# Altium project BOC1_06.PrjPcb (part 2 of 2)

## Sheet BOC_DAUGHTER.SchDoc: Board-On-Chip Daughter Connectors
size B; Organization: Altium Limited; Address1: L3, 12a Rodborough Rd; Address2: Frenchs Forest; Address3: NSW; Address4: Australia 2086; Revision: 1.06; SheetNumber: 8; SheetTotal: 16
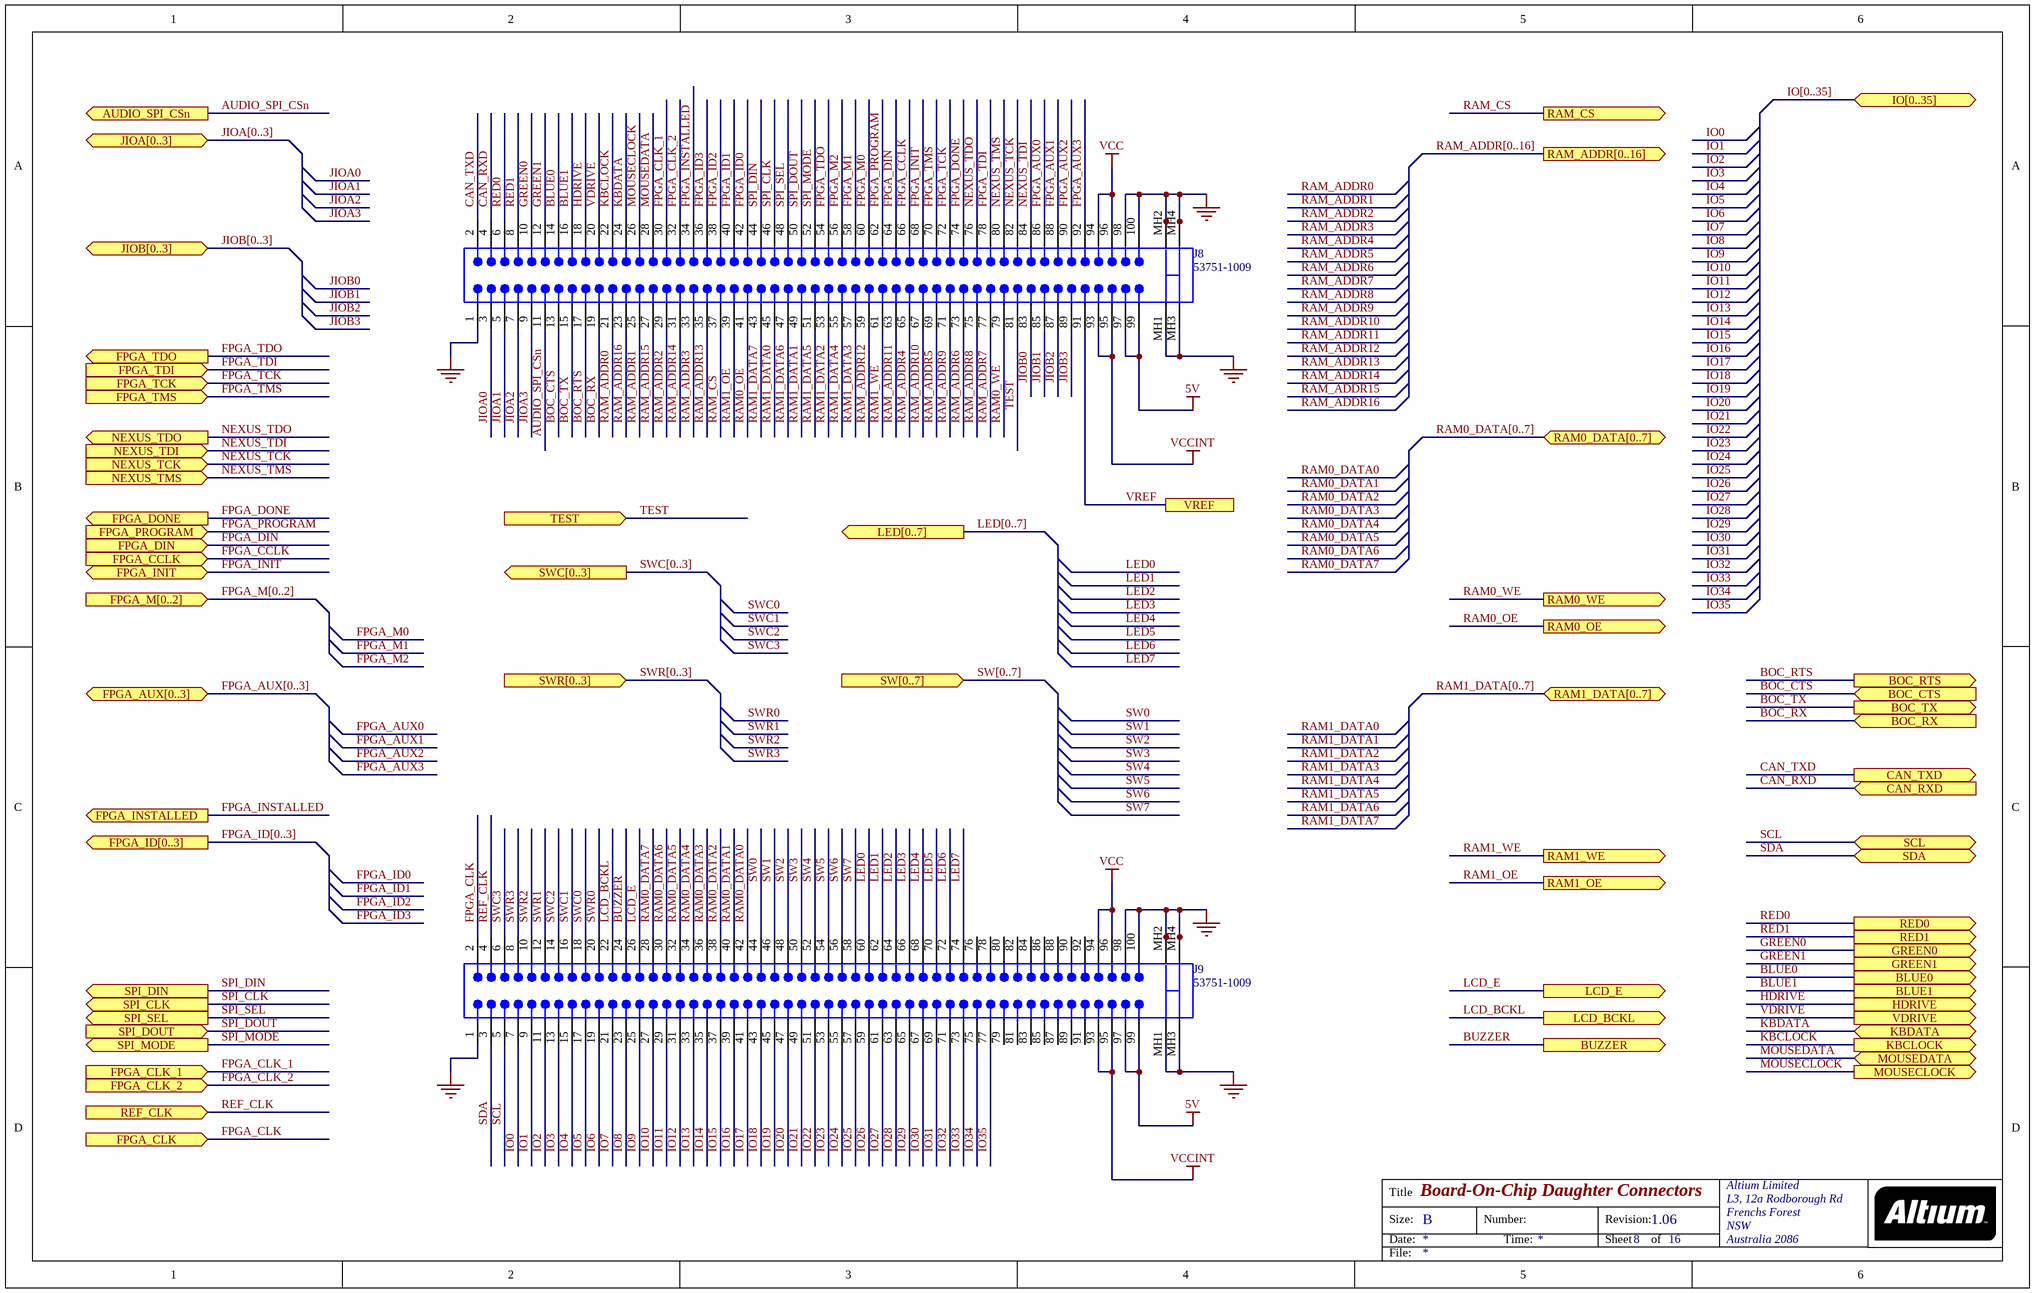
[diagram p13: BOC_DAUGHTER.SchDoc]

### Parts
J8  53751-1009  [53751]
J9  53751-1009  [53751]

### Ports
AUDIO_SPI_CSn (out), BLUE0 (out), BLUE1 (out), BOC_CTS (in), BOC_RTS (out), BOC_RX (in), BOC_TX (out), BUZZER (out), CAN_RXD (in), CAN_TXD (out), FPGA_AUX[0..3] (bidir), FPGA_CCLK (in), FPGA_CLK (in), FPGA_CLK_1 (in), FPGA_CLK_2 (in), FPGA_DIN (in), FPGA_DONE (out), FPGA_ID[0..3] (out), FPGA_INIT (bidir), FPGA_INSTALLED (out), FPGA_M[0..2] (in), FPGA_PROGRAM (in), FPGA_TCK (in), FPGA_TDI (in), FPGA_TDO (out), FPGA_TMS (in), GREEN0 (out), GREEN1 (out), HDRIVE (out), IO[0..35] (bidir), JIOA[0..3] (bidir), JIOB[0..3] (bidir), KBCLOCK (out), KBDATA (bidir), LCD_BCKL (out), LCD_E (out), LED[0..7] (out), MOUSECLOCK (out), MOUSEDATA (bidir), NEXUS_TCK (in), NEXUS_TDI (in), NEXUS_TDO (out), NEXUS_TMS (in), RAM0_DATA[0..7] (bidir), RAM0_OE (out), RAM0_WE (out), RAM1_DATA[0..7] (bidir), RAM1_OE (out), RAM1_WE (out), RAM_ADDR[0..16] (out), RAM_CS (out), RED0 (out), RED1 (out), REF_CLK (in), SCL (bidir), SDA (bidir), SPI_CLK (out), SPI_DIN (out), SPI_DOUT (in), SPI_MODE (out), SPI_SEL (out), SW[0..7] (in), SWC[0..3] (out), SWR[0..3] (in), TEST (in), VDRIVE (out), VREF

### Nets
5V: J8.97 J8.99 J9.97 J9.99
GND: J8.1 J8.98 J8.100 J8.MH1 J8.MH2 J8.MH2A J8.MH2B J8.MH3 J8.MH4 J8.MH4A J8.MH4B J9.1 J9.98 J9.100 J9.MH1 J9.MH2 J9.MH2A J9.MH2B J9.MH3 J9.MH4 J9.MH4A J9.MH4B
VCC: J8.94 J8.96 J9.94 J9.96
VCCINT: J8.93 J8.95 J9.93 J9.95
AUDIO_SPI_CSn: J8.11 ; port AUDIO_SPI_CSn
BLUE0: J8.14 ; port BLUE0
BLUE1: J8.16 ; port BLUE1
BOC_CTS: J8.13 ; port BOC_CTS
BOC_RTS: J8.17 ; port BOC_RTS
BOC_RX: J8.19 ; port BOC_RX
BOC_TX: J8.15 ; port BOC_TX
BUZZER: J9.24 ; port BUZZER
CAN_RXD: J8.4 ; port CAN_RXD
CAN_TXD: J8.2 ; port CAN_TXD
FPGA_AUX0: J8.86
FPGA_AUX1: J8.88
FPGA_AUX2: J8.90
FPGA_AUX3: J8.92
FPGA_CCLK: J8.66 ; port FPGA_CCLK
FPGA_CLK: J9.2 ; port FPGA_CLK
FPGA_CLK_1: J8.30 ; port FPGA_CLK_1
FPGA_CLK_2: J8.32 ; port FPGA_CLK_2
FPGA_DIN: J8.64 ; port FPGA_DIN
FPGA_DONE: J8.74 ; port FPGA_DONE
FPGA_ID0: J8.42
FPGA_ID1: J8.40
FPGA_ID2: J8.38
FPGA_ID3: J8.36
FPGA_INIT: J8.68 ; port FPGA_INIT
FPGA_INSTALLED: J8.34 ; port FPGA_INSTALLED
FPGA_M0: J8.60
FPGA_M1: J8.58
FPGA_M2: J8.56
FPGA_PROGRAM: J8.62 ; port FPGA_PROGRAM
FPGA_TCK: J8.72 ; port FPGA_TCK
FPGA_TDI: J8.78 ; port FPGA_TDI
FPGA_TDO: J8.54 ; port FPGA_TDO
FPGA_TMS: J8.70 ; port FPGA_TMS
GREEN0: J8.10 ; port GREEN0
GREEN1: J8.12 ; port GREEN1
HDRIVE: J8.18 ; port HDRIVE
IO0: J9.7
IO1: J9.9
IO2: J9.11
IO3: J9.13
IO4: J9.15
IO5: J9.17
IO6: J9.19
IO7: J9.21
IO8: J9.23
IO9: J9.25
IO10: J9.27
IO11: J9.29
IO12: J9.31
IO13: J9.33
IO14: J9.35
IO15: J9.37
IO16: J9.39
IO17: J9.41
IO18: J9.43
IO19: J9.45
IO20: J9.47
IO21: J9.49
IO22: J9.51
IO23: J9.53
IO24: J9.55
IO25: J9.57
IO26: J9.59
IO27: J9.61
IO28: J9.63
IO29: J9.65
IO30: J9.67
IO31: J9.69
IO32: J9.71
IO33: J9.73
IO34: J9.75
IO35: J9.77
JIOA0: J8.3
JIOA1: J8.5
JIOA2: J8.7
JIOA3: J8.9
JIOB0: J8.83
JIOB1: J8.85
JIOB2: J8.87
JIOB3: J8.89
KBCLOCK: J8.22 ; port KBCLOCK
KBDATA: J8.24 ; port KBDATA
LCD_BCKL: J9.22 ; port LCD_BCKL
LCD_E: J9.26 ; port LCD_E
LED0: J9.60
LED1: J9.62
LED2: J9.64
LED3: J9.66
LED4: J9.68
LED5: J9.70
LED6: J9.72
LED7: J9.74
MOUSECLOCK: J8.26 ; port MOUSECLOCK
MOUSEDATA: J8.28 ; port MOUSEDATA
NEXUS_TCK: J8.82 ; port NEXUS_TCK
NEXUS_TDI: J8.84 ; port NEXUS_TDI
NEXUS_TDO: J8.76 ; port NEXUS_TDO
NEXUS_TMS: J8.80 ; port NEXUS_TMS
RAM0_DATA0: J9.42
RAM0_DATA1: J9.40
RAM0_DATA2: J9.38
RAM0_DATA3: J9.36
RAM0_DATA4: J9.34
RAM0_DATA5: J9.32
RAM0_DATA6: J9.30
RAM0_DATA7: J9.28
RAM0_OE: J8.41 ; port RAM0_OE
RAM0_WE: J8.79 ; port RAM0_WE
RAM1_DATA0: J8.45
RAM1_DATA1: J8.49
RAM1_DATA2: J8.53
RAM1_DATA3: J8.57
RAM1_DATA4: J8.55
RAM1_DATA5: J8.51
RAM1_DATA6: J8.47
RAM1_DATA7: J8.43
RAM1_OE: J8.39 ; port RAM1_OE
RAM1_WE: J8.61 ; port RAM1_WE
RAM_ADDR0: J8.21
RAM_ADDR1: J8.25
RAM_ADDR2: J8.29
RAM_ADDR3: J8.33
RAM_ADDR4: J8.65
RAM_ADDR5: J8.69
RAM_ADDR6: J8.73
RAM_ADDR7: J8.77
RAM_ADDR8: J8.75
RAM_ADDR9: J8.71
RAM_ADDR10: J8.67
RAM_ADDR11: J8.63
RAM_ADDR12: J8.59
RAM_ADDR13: J8.35
RAM_ADDR14: J8.31
RAM_ADDR15: J8.27
RAM_ADDR16: J8.23
RAM_CS: J8.37 ; port RAM_CS
RED0: J8.6 ; port RED0
RED1: J8.8 ; port RED1
REF_CLK: J9.4 ; port REF_CLK
SCL: J9.5 ; port SCL
SDA: J9.3 ; port SDA
SPI_CLK: J8.46 ; port SPI_CLK
SPI_DIN: J8.44 ; port SPI_DIN
SPI_DOUT: J8.50 ; port SPI_DOUT
SPI_MODE: J8.52 ; port SPI_MODE
SPI_SEL: J8.48 ; port SPI_SEL
SW0: J9.44
SW1: J9.46
SW2: J9.48
SW3: J9.50
SW4: J9.52
SW5: J9.54
SW6: J9.56
SW7: J9.58
SWC0: J9.18
SWC1: J9.16
SWC2: J9.14
SWC3: J9.6
SWR0: J9.20
SWR1: J9.12
SWR2: J9.10
SWR3: J9.8
TEST: J8.81 ; port TEST
VDRIVE: J8.20 ; port VDRIVE
VREF: J8.91 ; port VREF

Not connected (* = marked no-connect by the designer): J9 76 78 79 80 81 82 83 84 85 86 87 88 89 90 91 92

### Buses and harness runs
bus FPGA_AUX[0..3] = port FPGA_AUX[0..3]
bus FPGA_ID[0..3] = port FPGA_ID[0..3]
bus FPGA_M[0..2] = port FPGA_M[0..2]
bus IO[0..35] = port IO[0..35]
bus JIOA[0..3] = port JIOA[0..3]
bus JIOB[0..3] = port JIOB[0..3]
bus LED[0..7] = port LED[0..7]
bus RAM0_DATA[0..7] = port RAM0_DATA[0..7]
bus RAM1_DATA[0..7] = port RAM1_DATA[0..7]
bus RAM_ADDR[0..16] = port RAM_ADDR[0..16]
bus SW[0..7] = port SW[0..7]
bus SWC[0..3] = port SWC[0..3]
bus SWR[0..3] = port SWR[0..3]

### Notes on the sheet
- Title
- Size:
- Date:
- B
- Number:
- Time:
- Revision:
- Sheet
- of
- File:

### Library data of the parts
J8 J9 = 53751-1009: Board-to-Board, Docking Station, 0.80mm (.031") Pitch, Shielded Plug, Vertical, Ultra Low Profile, SMT; Manufacturer: Molex; Package Information: Latest Revision: Jun-2001; Mating Height: 8.5mm; Voltage: 100V; Current: 0.5A; Contact Resistance: 40mOhm max; PCB Layout: Complies with Manufacturer's Recommendation.; Fitted: True; Published: 15-Oct-2003; Datasheet: Latest Revision: Feb-2002; Package Reference: 53751; Publisher: Altium Limited

## Sheet BOC_Boot.SchDoc: Board-On-Chip Bootup Circuits
size B; Organization: Altium Limited; Address1: L3, 12a Rodborough Rd; Address2: Frenchs Forest; Address3: NSW; Address4: Australia 2086; Revision: 1.06; SheetNumber: 2; SheetTotal: 16
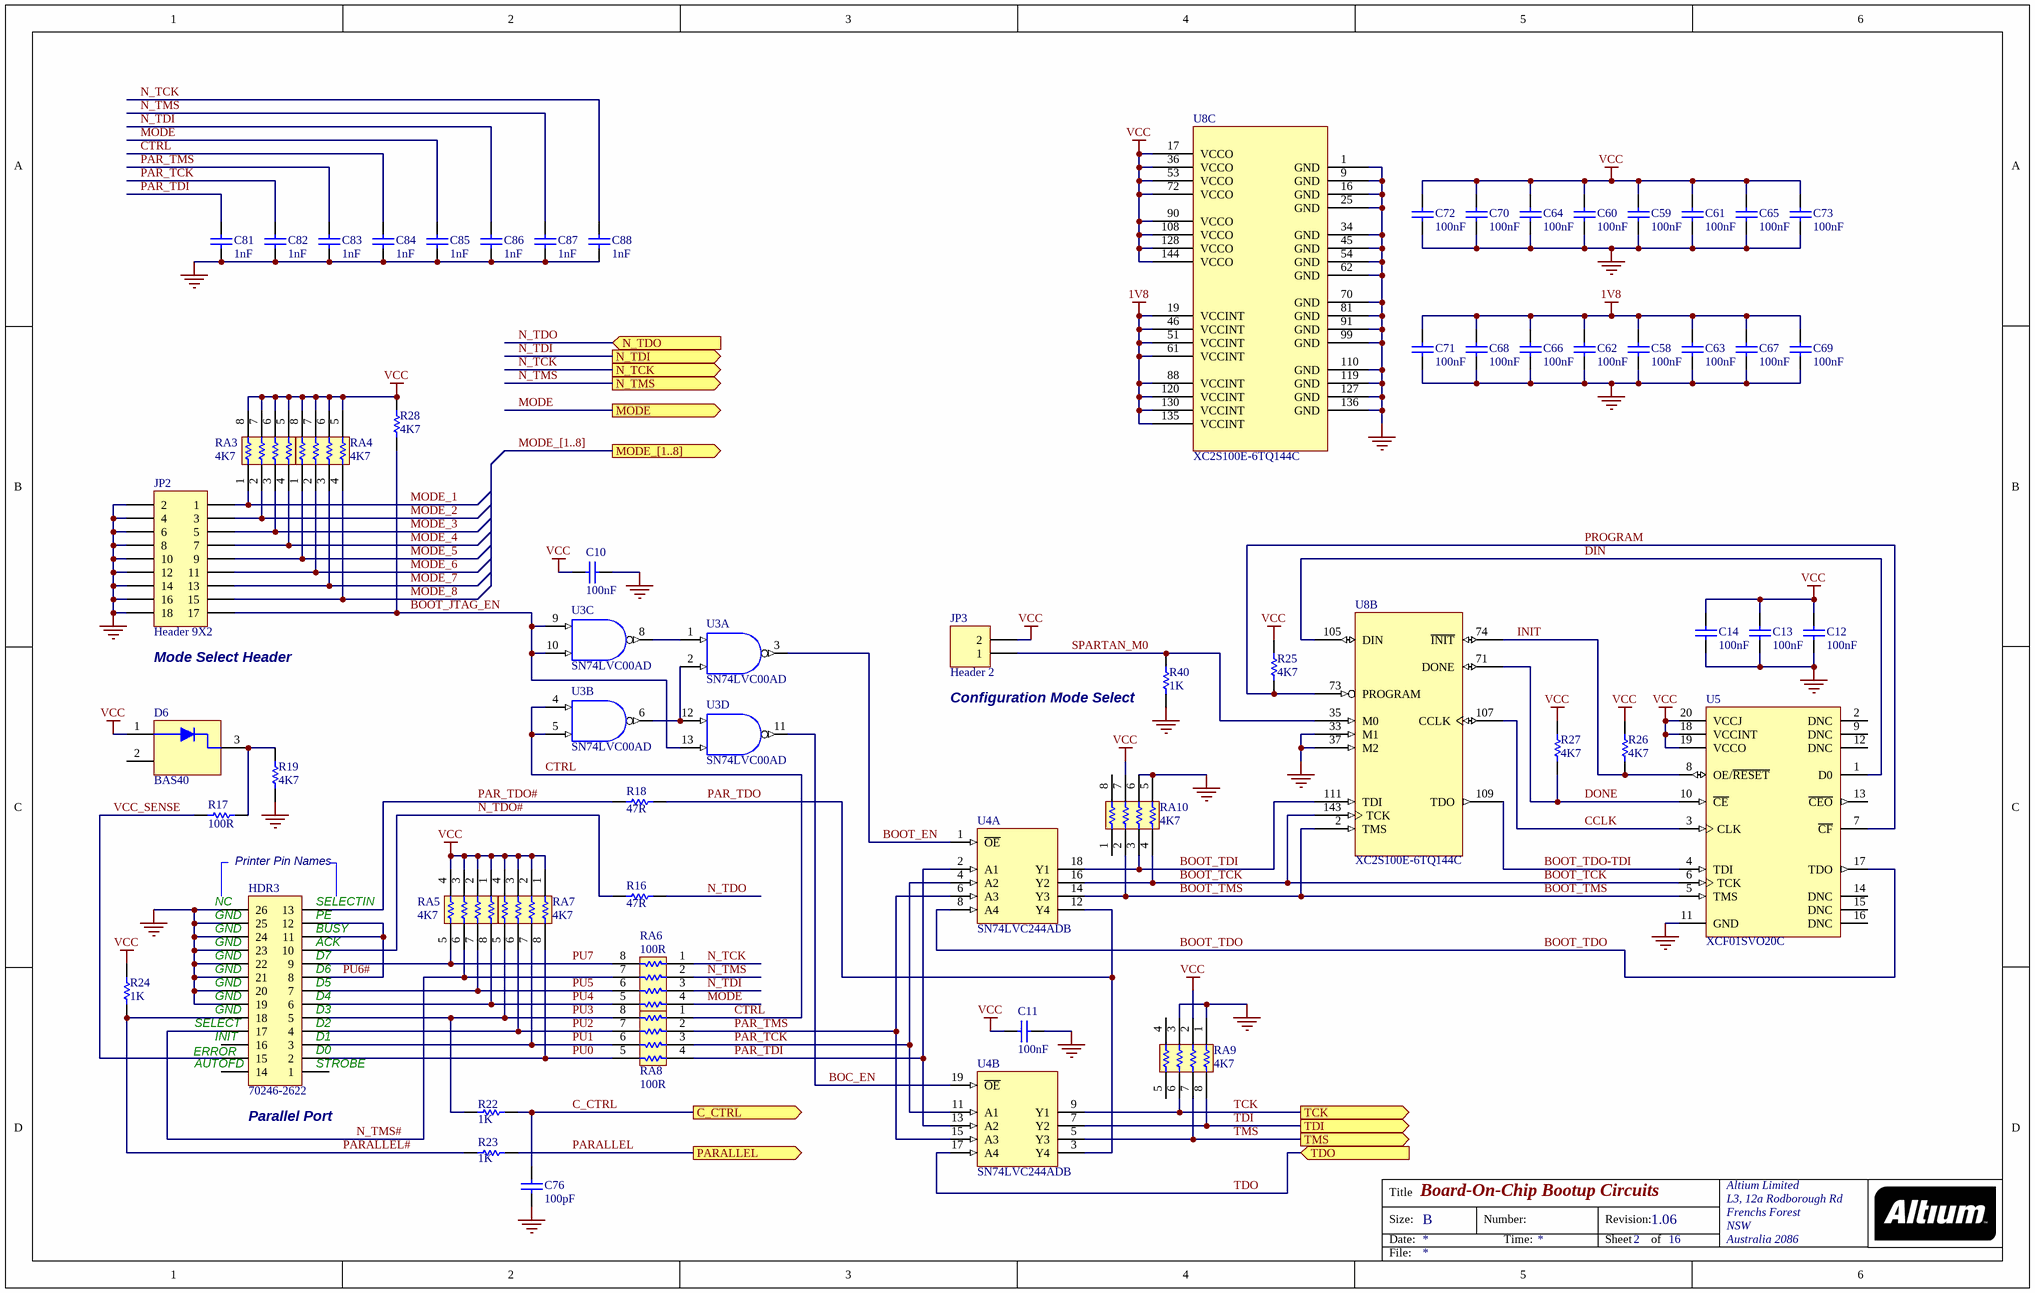
[diagram p14: BOC_Boot.SchDoc]

### Parts
C10  100nF  [CC2012-0805]
C11  100nF  [CC2012-0805]
C12  100nF  [CC2012-0805]
C13  100nF  [CC2012-0805]
C14  100nF  [CC2012-0805]
C58  100nF  [CC2012-0805]
C59  100nF  [CC2012-0805]
C60  100nF  [CC2012-0805]
C61  100nF  [CC2012-0805]
C62  100nF  [CC2012-0805]
C63  100nF  [CC2012-0805]
C64  100nF  [CC2012-0805]
C65  100nF  [CC2012-0805]
C66  100nF  [CC2012-0805]
C67  100nF  [CC2012-0805]
C68  100nF  [CC2012-0805]
C69  100nF  [CC2012-0805]
C70  100nF  [CC2012-0805]
C71  100nF  [CC2012-0805]
C72  100nF  [CC2012-0805]
C73  100nF  [CC2012-0805]
C76  100pF  [CC2012-0805]
C81  1nF  [CC2012-0805]
C82  1nF  [CC2012-0805]
C83  1nF  [CC2012-0805]
C84  1nF  [CC2012-0805]
C85  1nF  [CC2012-0805]
C86  1nF  [CC2012-0805]
C87  1nF  [CC2012-0805]
C88  1nF  [CC2012-0805]
D6  BAS40  [SO-G3]
HDR3  70246-2622  Usage: Parallel Port  [HDR2X13_CEN_LP]
JP2  Header 9X2  Usage: Mode Select Header  [HDR2X9]
JP3  Header 2  Usage: Configuration Mode Select  [HDR1X2]
R16  47R  [CC2012-0805]
R17  100R  [CC2012-0805]
R18  47R  [CC2012-0805]
R19  4K7  [CC2012-0805]
R22  1K  [CC2012-0805]
R23  1K  [CC2012-0805]
R24  1K  [CC2012-0805]
R25  4K7  [CC2012-0805]
R26  4K7  [CC2012-0805]
R27  4K7  [CC2012-0805]
R28  4K7  [CC2012-0805]
R40  1K  [CC2012-0805]
RA3  4K7  [MNR34]
RA4  4K7  [MNR34]
RA5  4K7  [MNR34]
RA6  100R  [MNR34]
RA7  4K7  [MNR34]
RA8  100R  [MNR34]
RA9  4K7  [MNR34]
RA10  4K7  [MNR34]
U3  SN74LVC00AD  [SO-G14/Y2.2]  (parts A,B,C,D of 4)
U4  SN74LVC244ADB  [SSO-G20/P.65]  (parts A,B of 2)
U5  XCF01SVO20C  [VO20]
U8  XC2S100E-6TQ144C  [TQ144]  (parts B,C of 3)

### Ports
C_CTRL (out), MODE (out), MODE_[1..8] (out), N_TCK (out), N_TDI (out), N_TDO (in), N_TMS (out), PARALLEL (out), TCK (out), TDI (out), TDO (in), TMS (out)

### Nets
1V8: C58.1 C62.1 C63.1 C66.1 C67.1 C68.1 C69.1 C71.1 U8.19(VCCINT) U8.46(VCCINT) U8.51(VCCINT) U8.61(VCCINT) U8.88(VCCINT) U8.120(VCCINT) U8.130(VCCINT) U8.135(VCCINT)
GND: C10.2 C11.2 C12.1 C13.1 C14.1 C58.2 C59.2 C60.2 C61.2 C62.2 C63.2 C64.2 C65.2 C66.2 C67.2 C68.2 C69.2 C70.2 C71.2 C72.2 C73.2 C76.2 C81.2 C82.2 C83.2 C84.2 C85.2 C86.2 C87.2 C88.2 HDR3.19 HDR3.20 HDR3.21 HDR3.22 HDR3.23 HDR3.24 HDR3.25 HDR3.26 JP2.2 JP2.4 JP2.6 JP2.8 JP2.10 JP2.12 JP2.14 JP2.16 JP2.18 R19.2 R40.1 RA9.1 RA9.3 RA10.5 RA10.6 U3.7(GND) U4.10(GND) U5.11(GND) U8.1(GND) U8.9(GND) U8.16(GND) U8.25(GND) U8.33(M1) U8.34(GND) U8.37(M2) U8.45(GND) U8.54(GND) U8.62(GND) U8.70(GND) U8.81(GND) U8.91(GND) U8.99(GND) U8.110(GND) U8.119(GND) U8.127(GND) U8.136(GND)
VCC: C10.1 C11.1 C12.2 C13.2 C14.2 C59.1 C60.1 C61.1 C64.1 C65.1 C70.1 C72.1 C73.1 D6.1 JP3.2 R24.2 R25.1 R26.1 R27.1 R28.2 RA3.5 RA3.6 RA3.7 RA3.8 RA4.5 RA4.6 RA4.7 RA4.8 RA5.1 RA5.2 RA5.3 RA5.4 RA7.1 RA7.2 RA7.3 RA7.4 RA9.2 RA10.7 U3.14(VDD) U4.20(VCC) U5.18(VCCINT) U5.19(VCCO) U5.20(VCCJ) U8.17(VCCO) U8.36(VCCO) U8.53(VCCO) U8.72(VCCO) U8.90(VCCO) U8.108(VCCO) U8.128(VCCO) U8.144(VCCO)
BOC_EN: U3.11(Y) U4.19(~{OE})
BOOT_EN: U3.3(Y) U4.1(~{OE})
BOOT_JTAG_EN: JP2.17 R28.1 U3.9(A) U3.10(B) U3.13(B)
BOOT_TCK: RA10.4 U4.16(Y2) U5.6(TCK) U8.143(TCK)
BOOT_TDI: RA10.3 U4.18(Y1) U8.111(TDI)
BOOT_TDO: U4.8(A4) U5.17(TDO)
BOOT_TDO-TDI: U5.4(TDI) U8.109(TDO)
BOOT_TMS: RA10.2 U4.14(Y3) U5.5(TMS) U8.2(TMS)
C_CTRL: C76.1 R22.2 ; port C_CTRL
CCLK: U5.3(CLK) U8.107(CCLK)
CTRL: C84.1 RA8.1 U3.4(A) U3.5(B)
DIN: U5.1(D0) U8.105(DIN)
DONE: R27.2 U5.10(~{CE}) U8.71(DONE)
INIT: R26.2 U5.8(OE/~{RESET}) U8.74(~{INIT})
MODE: C85.1 RA6.4 ; port MODE
MODE_1: JP2.1 RA3.1
MODE_2: JP2.3 RA3.2
MODE_3: JP2.5 RA3.3
MODE_4: JP2.7 RA3.4
MODE_5: JP2.9 RA4.1
MODE_6: JP2.11 RA4.2
MODE_7: JP2.13 RA4.3
MODE_8: JP2.15 RA4.4
N_TCK: C88.1 RA6.1 ; port N_TCK
N_TDI: C86.1 RA6.3 ; port N_TDI
N_TDO: R16.2 ; port N_TDO
N_TDO#: HDR3.10 R16.1
N_TMS: C87.1 RA6.2 ; port N_TMS
N_TMS#: HDR3.17 RA5.6 RA6.7
PAR_TCK: C82.1 RA8.3 U4.4(A2) U4.11(A1)
PAR_TDI: C81.1 RA8.4 U4.2(A1) U4.13(A2)
PAR_TDO: R18.2 U4.3(Y4) U4.12(Y4)
PAR_TDO#: HDR3.13 R18.1
PAR_TMS: C83.1 RA8.2 U4.6(A3) U4.15(A3)
PARALLEL: R23.2 ; port PARALLEL
PARALLEL#: HDR3.18 R23.1 R24.1
PROGRAM: R25.2 U5.7(~{CF}) U8.73(PROGRAM)
PU0: HDR3.2 RA7.8 RA8.5
PU1: HDR3.3 RA7.7 RA8.6
PU2: HDR3.4 RA7.6 RA8.7
PU3: HDR3.5 R22.1 RA7.5 RA8.8
PU4: HDR3.6 RA5.8 RA6.5
PU5: HDR3.7 RA5.7 RA6.6
PU6#: HDR3.8 HDR3.11 HDR3.12
PU7: HDR3.9 RA5.5 RA6.8
SPARTAN_M0: JP3.1 R40.2 U8.35(M0)
TCK: RA9.6 U4.9(Y1) ; port TCK
TDI: RA9.8 U4.7(Y2) ; port TDI
TDO: U4.17(A4) ; port TDO
TMS: RA9.7 U4.5(Y3) ; port TMS
VCC_SENSE: HDR3.15 R17.1
NetD6_3: D6.3 R17.2 R19.1
NetU3_1: U3.1(A) U3.8(Y)
NetU3_2: U3.2(B) U3.6(Y) U3.12(A)

Not connected (* = marked no-connect by the designer): D6 2; HDR3 1 14 16; RA9 4 5; RA10 1 8; U5 2(DNC) 9(DNC) 12(DNC) 13(~{CEO}) 14(DNC) 15(DNC) 16(DNC)

### Buses and harness runs
bus MODE_[1..8] = port MODE_[1..8]

### Notes on the sheet
- (near HDR3) NC
- Printer Pin Names
- (near HDR3) SELECTIN
- (near HDR3) GND
- (near HDR3) PE
- (near HDR3) BUSY
- (near HDR3) ACK
- (near HDR3) D6
- (near HDR3) D7
- (near HDR3) SELECT
- (near HDR3) INIT
- (near HDR3) D1
- (near HDR3) D2
- (near HDR3) D3
- (near HDR3) D4
- (near HDR3) D5
- (near HDR3) ERROR
- (near HDR3) AUTOFD
- (near HDR3) STROBE
- (near HDR3) D0
- Title
- Size:
- Date:
- B
- Number:
- Time:
- Revision:
- Sheet
- of
- File:

### Library data of the parts
C10-C14 C58-C73 C76 C81-C88 = CAP: Capacitor; Fitted: True
D6 = BAS40: Shottky Diode; Fitted: True
HDR3 = Header 13X2A: Header, 13-Pin, Dual row; Manufacturer: Generic Components; Class I: Connector; Fitted: True; Revision: July-2002: Re-released for DXP Platform.; Publisher: Altium Limited
JP2 = Header 9X2: Header, 9-Pin, Dual row; Manufacturer: Generic Components; Class I: Connector; Fitted: True; Revision: July-2002: Re-released for DXP Platform.; Publisher: Altium Limited
JP3 = Header 2: Header, 2-Pin; Manufacturer: Generic Components; Class I: Connector; Fitted: True; Revision: July-2002: Re-released for DXP Platform.; Publisher: Altium Limited
R16-R19 R22-R28 R40 = RES: Resistor; Fitted: True
RA3-RA10 = MNR34: 3216x4 Resistor Array; Fitted: True
U3 = MC74HC00AD: Quad 2-Input NAND Gate; Manufacturer: Motorola; Package Information: Latest Revision: 1991; Class I: Logic; Fitted: True; Published: 15-Apr-2002; Datasheet: High-Speed CMOS Logic Data, DL129 Rev4 (1989); Package Reference: 751A-02; Publisher: Altium Limited; Class II: Gate
U4 = 74LVC244A: Octal Buffer/Driver with 3-State Outputs; Manufacturer: Philips; Package Information: Latest Revision: 1998; Class I: Logic; Class II: Buffer/Line Driver; Fitted: True; Published: 8-Jun-2000; Revision: July-2002: Re-released for DXP Platform.; Datasheet: Latest Revision: Jul-1998; Package Reference: SSOP20; Publisher: Altium Limited
U5 = XCF01SVO20C: XCF00S Series, Platform Flash In-System Programmable Configuration 3.3V PROM, 1-Megabit, Commercial Grade; Manufacturer: Xilinx; Package Information: Latest Revision: ver1.0, May-2003; Class I: Memory; Code - JEDEC: MO-153-AC; Fitted: True; Published: 20-Aug-2003; Datasheet: Latest Revision: ver1.1, June-2003; Package Reference: VO20; Publisher: Altium Limited; Class II: PROM
U8 = XC2S100E-6TQ144C: Spartan-IIE 1.8V FPGA, 144-Pin TQFP, Standard Performance, Commercial Grade; Manufacturer: Xilinx; Package Information: Latest Revision: ver1.1, Oct-2002; Class I: Field Programmable Gate Array; Code - JEDEC: MS-026-BFB; Code - IPC: SQFP20X20-144; Fitted: True; Published: 19-Jul-2002; Revision: 25-Aug-2003; Datasheet: Latest Revision: 14-Feb-2003; Package Reference: TQ144; Publisher: Altium Limited; Class II: Spartan-IIE

## Sheet BOC_Audio.SchDoc: Board-On-Chip Audio Interface
size A; Organization: Altium Limited; Address1: L3, 12a Rodborough Rd; Address2: Frenchs Forest; Address3: NSW; Address4: Australia 2086; Revision: 1.06; SheetNumber: 3; SheetTotal: 16
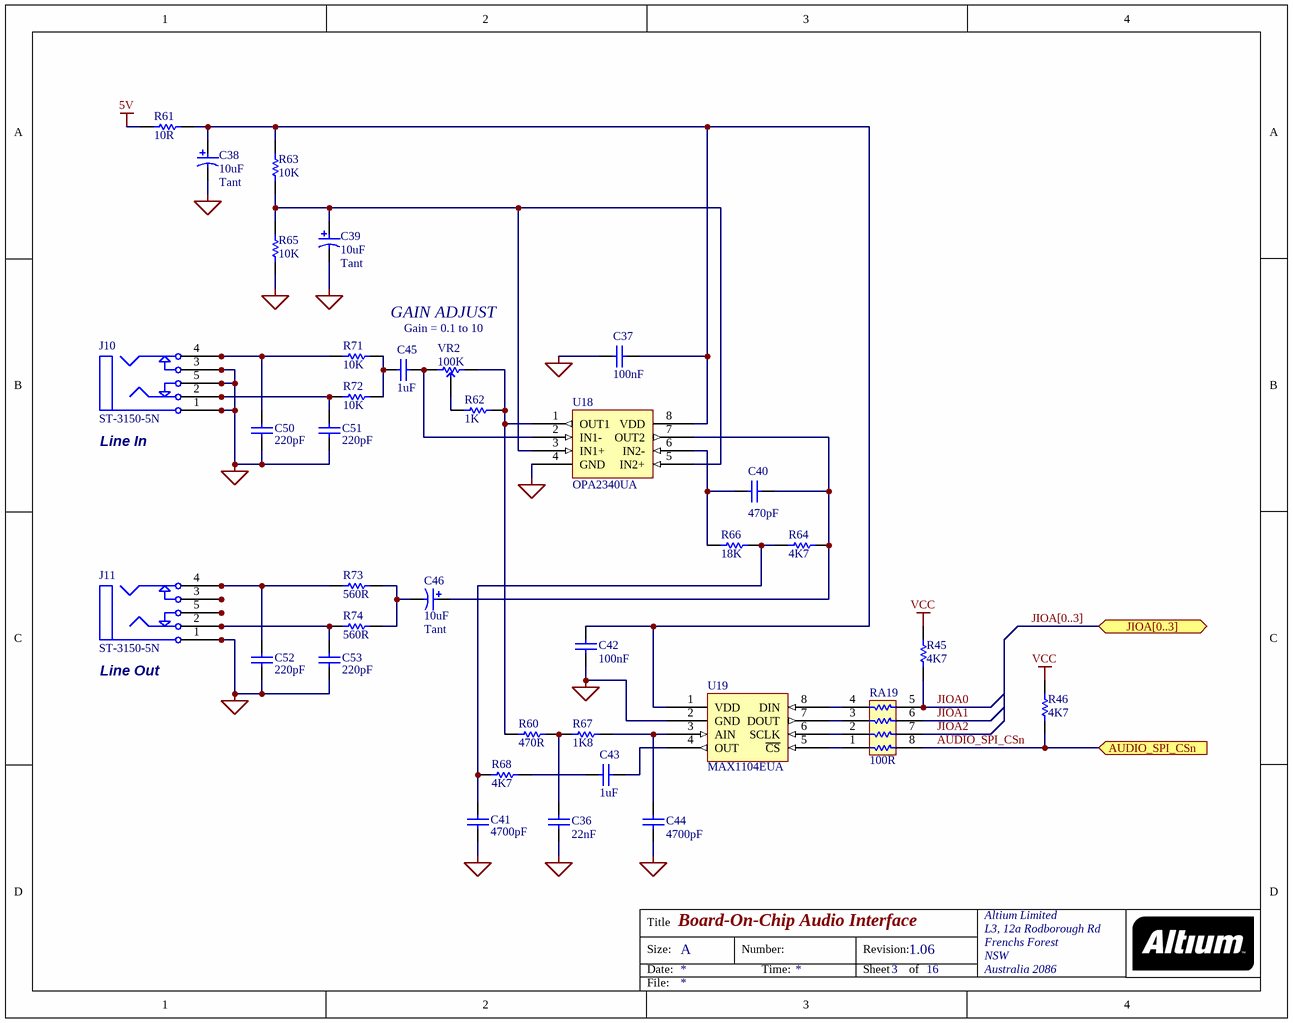
[diagram p15: BOC_Audio.SchDoc]

### Parts
C36  22nF  [CC2012-0805]
C37  100nF  [CC2012-0805]
C38  10uF  Capacitor Type: Tant  [MCCT-B]
C39  10uF  Capacitor Type: Tant  [MCCT-B]
C40  470pF  [CC2012-0805]
C41  4700pF  [CC2012-0805]
C42  100nF  [CC2012-0805]
C43  1uF  [C3216-1206]
C44  4700pF  [CC2012-0805]
C45  1uF  [C3216-1206]
C46  10uF  Capacitor Type: Tant  [MCCT-B]
C50  220pF  [CC2012-0805]
C51  220pF  [CC2012-0805]
C52  220pF  [CC2012-0805]
C53  220pF  [CC2012-0805]
J10  ST-3150-5N  [ST-3150-5N]
J11  ST-3150-5N  [ST-3150-5N]
R45  4K7  [CC2012-0805]
R46  4K7  [CC2012-0805]
R60  470R  [CC2012-0805]
R61  10R  [CC2012-0805]
R62  1K  [CC2012-0805]
R63  10K  [CC2012-0805]
R64  4K7  [CC2012-0805]
R65  10K  [CC2012-0805]
R66  18K  [CC2012-0805]
R67  1K8  [CC2012-0805]
R68  4K7  [CC2012-0805]
R71  10K  [CC2012-0805]
R72  10K  [CC2012-0805]
R73  560R  [CC2012-0805]
R74  560R  [CC2012-0805]
RA19  100R  [MNR34]
U18  OPA2340UA  [SO-G8]
U19  MAX1104EUA  [TSSO3X5-G8/X.35]
VR2  100K  [POT4MM-2]

### Ports
AUDIO_SPI_CSn (in), JIOA[0..3] (bidir)

### Nets
5V: R61.1
AGND: C36.2 C37.1 C38.2 C39.2 C41.2 C42.2 C44.2 C50.2 C51.2 C52.2 C53.2 J10.1 J10.1A J10.1B J10.3 J10.3A J10.3B J10.5 J10.5A J10.5B J11.1 J11.1A J11.1B R65.1 U18.4(GND) U19.2(GND)
VCC: R45.2 R46.2
AUDIO_SPI_CSn: R46.1 RA19.8 ; port AUDIO_SPI_CSn
JIOA0: R45.1 RA19.5
JIOA1: RA19.6
JIOA2: RA19.7
NetC36_1: C36.1 R60.2 R67.1
NetC37_2: C37.2 C38.1 C42.1 R61.2 R63.2 U18.8(VDD) U19.1(VDD)
NetC39_1: C39.1 R63.1 R65.2 U18.3(IN1+) U18.5(IN2+)
NetC40_1: C40.1 R66.2 U18.6(IN2-)
NetC40_2: C40.2 C46.1 R64.1 U18.7(OUT2)
NetC41_1: C41.1 R64.2 R66.1 R68.1
NetC43_1: C43.1 R68.2
NetC43_2: C43.2 U19.4(OUT)
NetC44_1: C44.1 R67.2 U19.3(AIN)
NetC45_1: C45.1 R71.2 R72.2
NetC45_2: C45.2 U18.2(IN1-) VR2.CCW(-)
NetC46_2: C46.2 R73.2 R74.2
NetC50_1: C50.1 J10.4 J10.4A J10.4B R71.1
NetC51_1: C51.1 J10.2 J10.2A J10.2B R72.1
NetC52_1: C52.1 J11.4 J11.4A J11.4B R73.1
NetC53_1: C53.1 J11.2 J11.2A J11.2B R74.1
NetJ11_3: J11.3 J11.3A J11.3B
NetJ11_5: J11.5 J11.5A J11.5B
NetR60_1: R60.1 R62.2 U18.1(OUT1) VR2.CW(+)
NetR62_1: R62.1 VR2.W
NetRA19_1: RA19.1 U19.5(~{CS})
NetRA19_2: RA19.2 U19.6(SCLK)
NetRA19_3: RA19.3 U19.7(DOUT)
NetRA19_4: RA19.4 U19.8(DIN)

### Buses and harness runs
bus JIOA[0..3] = port JIOA[0..3]

### Notes on the sheet
- GAIN ADJUST
- Gain = 0.1 to 10
- (near J10) Line In
- (near J11) Line Out
- Title
- Size:
- Date:
- A
- Number:
- Time:
- Revision:
- Sheet
- of
- File:

### Library data of the parts
C36 C37 C40-C45 C50-C53 = CAP: Capacitor; Fitted: True
C38 C39 C46 = CAP_POLAR: Polar Capacitor; Fitted: True
J10 J11 = ST-3150-5N: 3-Conductor Jack with 2 break contacts (normals) and 2 auxiliary make contacts; Manufacturer: Kycon; Class I: Connector; Fitted: True; Revision: December-2003: Created for NanoBoard.; Publisher: Altium Limited
R45 R46 R60-R68 R71-R74 = RES: Resistor; Fitted: True
RA19 = MNR34: 3216x4 Resistor Array; Fitted: True
U18 = OPA2340UA: Manufacturer: Burr-Brown; Fitted: True
U19 = MAX1104EUA: 8 bit CODEC with 4 wire logic interface; Manufacturer: Maxim; Fitted: True
VR2 = POT_M: Potentiometer; Fitted: True

## Nets that join several sheets
1V8: BOC_PWR (C21.1 C23.1 R42.1 U9.2), BOC_Boot (16 pins)
5V: BOC_IO (JP5.2 JP6.2), BOC_PWR (9 pins), BOC_ADC_DAC (HDR8.2), BOC_CAN (C4.1 J2.4 U2.3), BOC_LCD (LCD1.15 Q2.2 R30.1 R38.1), BOC_Spartan (R5.1), BOC_DAUGHTER (J8.97 J8.99 J9.97 J9.99), BOC_Audio (R61.1)
AGND: BOC_ADC_DAC (12 pins), BOC_Audio (26 pins)
GND: BOC_SRAM (6 pins), BOC_IO (HDR9.20 HDR10.20), BOC_KB (SW17.3 SW17.4), BOC_PWR (42 pins), BOC_RS232 (7 pins), BOC_ADC_DAC (HDR8.14 R80.1), BOC_CAN (7 pins), BOC_LED_DIPSWITCH (16 pins), BOC_CLK_ADJ (8 pins), BOC_LCD (16 pins), BOC_VGA_KB_MOUSE (17 pins), BOC_Spartan (36 pins), BOC_DAUGHTER (22 pins), BOC_Boot (74 pins)
VCC: BOC_SRAM (7 pins), BOC_IO (JP5.3 JP6.3), BOC_KB (5 pins), BOC_PWR (C16.1 C25.1 R47.1 U10.2), BOC_RS232 (C1.1 C2.1 C3.1 U1.16), BOC_ADC_DAC (R75.2 R77.1 R79.1), BOC_LED_DIPSWITCH (8 pins), BOC_CLK_ADJ (7 pins), BOC_LCD (5 pins), BOC_VGA_KB_MOUSE (12 pins), BOC_Spartan (32 pins), BOC_DAUGHTER (J8.94 J8.96 J9.94 J9.96), BOC_Boot (51 pins), BOC_Audio (R45.2 R46.2)
VCCINT: BOC_PWR (C24.1 C35.1 R56.1 U11.2), BOC_DAUGHTER (J8.93 J8.95 J9.93 J9.95)
AUDIO_SPI_CSn: BOC_DAUGHTER (J8.11), BOC_Audio (R46.1 RA19.8)
BLUE0: BOC_VGA_KB_MOUSE (R14.1), BOC_DAUGHTER (J8.14)
BLUE1: BOC_VGA_KB_MOUSE (R15.1), BOC_DAUGHTER (J8.16)
BOC_CTS: BOC_RS232 (R9.1), BOC_DAUGHTER (J8.13)
BOC_RTS: BOC_RS232 (U1.10), BOC_DAUGHTER (J8.17)
BOC_RX: BOC_RS232 (R1.1), BOC_DAUGHTER (J8.19)
BOC_TX: BOC_RS232 (U1.11), BOC_DAUGHTER (J8.15)
BUZZER: BOC_LCD (R37.1), BOC_DAUGHTER (J9.24)
C_CTRL: BOC_Spartan (U8.80), BOC_Boot (C76.1 R22.2)
C_SPI_CLOCK_CLK: BOC_CLK_ADJ (U12.8), BOC_Spartan (U8.141)
C_SPI_CLOCK_SEL: BOC_CLK_ADJ (R50.1 U12.9), BOC_Spartan (U8.142)
C_SPI_DIN: BOC_CLK_ADJ (U12.12), BOC_Spartan (U6.5 U7.5 U8.140)
CAN_RXD: BOC_CAN (R4.1), BOC_DAUGHTER (J8.4)
CAN_TXD: BOC_CAN (U2.1), BOC_DAUGHTER (J8.2)
FPGA_AUX0: BOC_Spartan (U8.41), BOC_DAUGHTER (J8.86)
FPGA_AUX1: BOC_Spartan (U8.42), BOC_DAUGHTER (J8.88)
FPGA_AUX2: BOC_Spartan (U8.43), BOC_DAUGHTER (J8.90)
FPGA_AUX3: BOC_Spartan (U8.44), BOC_DAUGHTER (J8.92)
FPGA_CCLK: BOC_Spartan (U8.24), BOC_DAUGHTER (J8.66)
FPGA_CLK: BOC_CLK_ADJ (R51.2 R53.2), BOC_Spartan (U8.126), BOC_DAUGHTER (J9.2)
FPGA_CLK_1: BOC_Spartan (U8.3), BOC_DAUGHTER (J8.30)
FPGA_CLK_2: BOC_Spartan (U8.4), BOC_DAUGHTER (J8.32)
FPGA_DIN: BOC_Spartan (U8.23), BOC_DAUGHTER (J8.64)
FPGA_DONE: BOC_Spartan (U8.29), BOC_DAUGHTER (J8.74)
FPGA_ID0: BOC_Spartan (U8.10), BOC_DAUGHTER (J8.42)
FPGA_ID1: BOC_Spartan (U8.8), BOC_DAUGHTER (J8.40)
FPGA_ID2: BOC_Spartan (U8.7), BOC_DAUGHTER (J8.38)
FPGA_ID3: BOC_Spartan (U8.6), BOC_DAUGHTER (J8.36)
FPGA_INIT: BOC_Spartan (U8.26), BOC_DAUGHTER (J8.68)
FPGA_INSTALLED: BOC_Spartan (R44.2 U8.5), BOC_DAUGHTER (J8.34)
FPGA_M0: BOC_Spartan (U8.21), BOC_DAUGHTER (J8.60)
FPGA_M1: BOC_Spartan (U8.20), BOC_DAUGHTER (J8.58)
FPGA_M2: BOC_Spartan (U8.18), BOC_DAUGHTER (J8.56)
FPGA_PROGRAM: BOC_Spartan (U8.22), BOC_DAUGHTER (J8.62)
FPGA_TCK: BOC_Spartan (U8.28), BOC_DAUGHTER (J8.72)
FPGA_TDI: BOC_Spartan (U8.31), BOC_DAUGHTER (J8.78)
FPGA_TDO: BOC_Spartan (RA16.1), BOC_DAUGHTER (J8.54)
FPGA_TMS: BOC_Spartan (U8.27), BOC_DAUGHTER (J8.70)
GREEN0: BOC_VGA_KB_MOUSE (R12.1), BOC_DAUGHTER (J8.10)
GREEN1: BOC_VGA_KB_MOUSE (R13.1), BOC_DAUGHTER (J8.12)
HDRIVE: BOC_VGA_KB_MOUSE (D4.3 J3.13), BOC_DAUGHTER (J8.18)
IO0: BOC_IO (HDR9.2), BOC_DAUGHTER (J9.7)
IO1: BOC_IO (HDR9.3), BOC_DAUGHTER (J9.9)
IO2: BOC_IO (HDR9.4), BOC_DAUGHTER (J9.11)
IO3: BOC_IO (HDR9.5), BOC_DAUGHTER (J9.13)
IO4: BOC_IO (HDR9.6), BOC_DAUGHTER (J9.15)
IO5: BOC_IO (HDR9.7), BOC_DAUGHTER (J9.17)
IO6: BOC_IO (HDR9.8), BOC_DAUGHTER (J9.19)
IO7: BOC_IO (HDR9.9), BOC_DAUGHTER (J9.21)
IO8: BOC_IO (HDR9.10), BOC_DAUGHTER (J9.23)
IO9: BOC_IO (HDR9.11), BOC_DAUGHTER (J9.25)
IO10: BOC_IO (HDR9.12), BOC_DAUGHTER (J9.27)
IO11: BOC_IO (HDR9.13), BOC_DAUGHTER (J9.29)
IO12: BOC_IO (HDR9.14), BOC_DAUGHTER (J9.31)
IO13: BOC_IO (HDR9.15), BOC_DAUGHTER (J9.33)
IO14: BOC_IO (HDR9.16), BOC_DAUGHTER (J9.35)
IO15: BOC_IO (HDR9.17), BOC_DAUGHTER (J9.37)
IO16: BOC_IO (HDR9.18), BOC_DAUGHTER (J9.39)
IO17: BOC_IO (HDR9.19), BOC_DAUGHTER (J9.41)
IO18: BOC_IO (HDR10.2), BOC_DAUGHTER (J9.43)
IO19: BOC_IO (HDR10.3), BOC_DAUGHTER (J9.45)
IO20: BOC_IO (HDR10.4), BOC_DAUGHTER (J9.47)
IO21: BOC_IO (HDR10.5), BOC_DAUGHTER (J9.49)
IO22: BOC_IO (HDR10.6), BOC_DAUGHTER (J9.51)
IO23: BOC_IO (HDR10.7), BOC_DAUGHTER (J9.53)
IO24: BOC_IO (HDR10.8), BOC_DAUGHTER (J9.55)
IO25: BOC_IO (HDR10.9), BOC_DAUGHTER (J9.57)
IO26: BOC_IO (HDR10.10), BOC_DAUGHTER (J9.59)
IO27: BOC_IO (HDR10.11), BOC_DAUGHTER (J9.61)
IO28: BOC_IO (HDR10.12), BOC_DAUGHTER (J9.63)
IO29: BOC_IO (HDR10.13), BOC_DAUGHTER (J9.65)
IO30: BOC_IO (HDR10.14), BOC_DAUGHTER (J9.67)
IO31: BOC_IO (HDR10.15), BOC_DAUGHTER (J9.69)
IO32: BOC_IO (HDR10.16), BOC_DAUGHTER (J9.71)
IO33: BOC_IO (HDR10.17), BOC_DAUGHTER (J9.73)
IO34: BOC_IO (HDR10.18), BOC_DAUGHTER (J9.75)
IO35: BOC_IO (HDR10.19), BOC_DAUGHTER (J9.77)
JIOA0: BOC_Spartan (RA20.4), BOC_DAUGHTER (J8.3), BOC_Audio (R45.1 RA19.5)
JIOA1: BOC_Spartan (RA20.3), BOC_DAUGHTER (J8.5), BOC_Audio (RA19.6)
JIOA2: BOC_Spartan (RA20.2), BOC_DAUGHTER (J8.7), BOC_Audio (RA19.7)
JIOA3: BOC_Spartan (RA20.1), BOC_DAUGHTER (J8.9)
JIOB0: BOC_Spartan (RA17.1), BOC_DAUGHTER (J8.83)
JIOB1: BOC_Spartan (RA17.2), BOC_DAUGHTER (J8.85)
JIOB2: BOC_Spartan (RA17.3), BOC_DAUGHTER (J8.87)
JIOB3: BOC_Spartan (RA17.4), BOC_DAUGHTER (J8.89)
KBCLOCK: BOC_VGA_KB_MOUSE (J4.5 RA2.1), BOC_DAUGHTER (J8.22)
KBDATA: BOC_VGA_KB_MOUSE (J4.1 RA2.2), BOC_DAUGHTER (J8.24)
LCD_BCKL: BOC_LCD (R35.1), BOC_DAUGHTER (J9.22)
LCD_E: BOC_LCD (LCD1.6 R29.1 U16.2), BOC_DAUGHTER (J9.26)
LED0: BOC_LED_DIPSWITCH (LED0.1), BOC_DAUGHTER (J9.60)
LED1: BOC_LED_DIPSWITCH (LED1.1), BOC_DAUGHTER (J9.62)
LED2: BOC_LED_DIPSWITCH (LED2.1), BOC_DAUGHTER (J9.64)
LED3: BOC_LED_DIPSWITCH (LED3.1), BOC_DAUGHTER (J9.66)
LED4: BOC_LED_DIPSWITCH (LED4.1), BOC_DAUGHTER (J9.68)
LED5: BOC_LED_DIPSWITCH (LED5.1), BOC_DAUGHTER (J9.70)
LED6: BOC_LED_DIPSWITCH (LED6.1), BOC_DAUGHTER (J9.72)
LED7: BOC_LED_DIPSWITCH (LED7.1), BOC_DAUGHTER (J9.74)
MODE: BOC_Spartan (U8.82), BOC_Boot (C85.1 RA6.4)
MODE_1: BOC_Spartan (U8.97), BOC_Boot (JP2.1 RA3.1)
MODE_2: BOC_Spartan (U8.96), BOC_Boot (JP2.3 RA3.2)
MODE_3: BOC_Spartan (U8.95), BOC_Boot (JP2.5 RA3.3)
MODE_4: BOC_Spartan (U8.94), BOC_Boot (JP2.7 RA3.4)
MODE_5: BOC_Spartan (U8.93), BOC_Boot (JP2.9 RA4.1)
MODE_6: BOC_Spartan (U8.92), BOC_Boot (JP2.11 RA4.2)
MODE_7: BOC_Spartan (U8.89), BOC_Boot (JP2.13 RA4.3)
MODE_8: BOC_Spartan (U8.87), BOC_Boot (JP2.15 RA4.4)
MOUSECLOCK: BOC_VGA_KB_MOUSE (J5.5 RA2.3), BOC_DAUGHTER (J8.26)
MOUSEDATA: BOC_VGA_KB_MOUSE (J5.1 RA2.4), BOC_DAUGHTER (J8.28)
N_TCK: BOC_Spartan (U8.85), BOC_Boot (C88.1 RA6.1)
N_TDI: BOC_Spartan (U8.83), BOC_Boot (C86.1 RA6.3)
N_TDO: BOC_Spartan (U8.86), BOC_Boot (R16.2)
N_TMS: BOC_Spartan (U8.84), BOC_Boot (C87.1 RA6.2)
NEXUS_TCK: BOC_Spartan (RA16.3), BOC_DAUGHTER (J8.82)
NEXUS_TDI: BOC_Spartan (RA16.4), BOC_DAUGHTER (J8.84)
NEXUS_TDO: BOC_Spartan (U8.30), BOC_DAUGHTER (J8.76)
NEXUS_TMS: BOC_Spartan (RA16.2), BOC_DAUGHTER (J8.80)
PARALLEL: BOC_Spartan (U8.79), BOC_Boot (R23.2)
RAM0_DATA0: BOC_SRAM (U15.11), BOC_LCD (U17.11), BOC_DAUGHTER (J9.42)
RAM0_DATA1: BOC_SRAM (U15.10), BOC_LCD (U17.12), BOC_DAUGHTER (J9.40)
RAM0_DATA2: BOC_SRAM (U15.22), BOC_LCD (U17.13), BOC_DAUGHTER (J9.38)
RAM0_DATA3: BOC_SRAM (U15.23), BOC_LCD (U17.14), BOC_DAUGHTER (J9.36)
RAM0_DATA4: BOC_SRAM (U15.7), BOC_LCD (U17.15), BOC_DAUGHTER (J9.34)
RAM0_DATA5: BOC_SRAM (U15.26), BOC_LCD (U17.16), BOC_DAUGHTER (J9.32)
RAM0_DATA6: BOC_SRAM (U15.6), BOC_LCD (U17.17), BOC_DAUGHTER (J9.30)
RAM0_DATA7: BOC_SRAM (U15.27), BOC_LCD (U17.18), BOC_DAUGHTER (J9.28)
RAM0_OE: BOC_SRAM (U15.28), BOC_DAUGHTER (J8.41)
RAM0_WE: BOC_SRAM (U15.12), BOC_DAUGHTER (J8.79)
RAM1_DATA0: BOC_SRAM (U14.6), BOC_DAUGHTER (J8.45)
RAM1_DATA1: BOC_SRAM (U14.7), BOC_DAUGHTER (J8.49)
RAM1_DATA2: BOC_SRAM (U14.10), BOC_DAUGHTER (J8.53)
RAM1_DATA3: BOC_SRAM (U14.11), BOC_DAUGHTER (J8.57)
RAM1_DATA4: BOC_SRAM (U14.22), BOC_DAUGHTER (J8.55)
RAM1_DATA5: BOC_SRAM (U14.23), BOC_DAUGHTER (J8.51)
RAM1_DATA6: BOC_SRAM (U14.26), BOC_DAUGHTER (J8.47)
RAM1_DATA7: BOC_SRAM (U14.27), BOC_DAUGHTER (J8.43)
RAM1_OE: BOC_SRAM (U14.28), BOC_DAUGHTER (J8.39)
RAM1_WE: BOC_SRAM (U14.12), BOC_DAUGHTER (J8.61)
RAM_ADDR0: BOC_SRAM (U14.1 U15.1), BOC_LCD (LCD1.4), BOC_DAUGHTER (J8.21)
RAM_ADDR1: BOC_SRAM (U14.2 U15.2), BOC_LCD (LCD1.5 U17.1), BOC_DAUGHTER (J8.25)
RAM_ADDR2: BOC_SRAM (U14.3 U15.3), BOC_DAUGHTER (J8.29)
RAM_ADDR3: BOC_SRAM (U14.4 U15.4), BOC_DAUGHTER (J8.33)
RAM_ADDR4: BOC_SRAM (U14.13 U15.13), BOC_DAUGHTER (J8.65)
RAM_ADDR5: BOC_SRAM (U14.14 U15.14), BOC_DAUGHTER (J8.69)
RAM_ADDR6: BOC_SRAM (U14.15 U15.15), BOC_DAUGHTER (J8.73)
RAM_ADDR7: BOC_SRAM (U14.16 U15.16), BOC_DAUGHTER (J8.77)
RAM_ADDR8: BOC_SRAM (U14.17 U15.17), BOC_DAUGHTER (J8.75)
RAM_ADDR9: BOC_SRAM (U14.18 U15.18), BOC_DAUGHTER (J8.71)
RAM_ADDR10: BOC_SRAM (U14.19 U15.19), BOC_DAUGHTER (J8.67)
RAM_ADDR11: BOC_SRAM (U14.20 U15.20), BOC_DAUGHTER (J8.63)
RAM_ADDR12: BOC_SRAM (U14.21 U15.21), BOC_DAUGHTER (J8.59)
RAM_ADDR13: BOC_SRAM (U14.29 U15.29), BOC_DAUGHTER (J8.35)
RAM_ADDR14: BOC_SRAM (U14.30 U15.30), BOC_DAUGHTER (J8.31)
RAM_ADDR15: BOC_SRAM (U14.31 U15.31), BOC_DAUGHTER (J8.27)
RAM_ADDR16: BOC_SRAM (U14.32 U15.32), BOC_DAUGHTER (J8.23)
RAM_CS: BOC_SRAM (R59.2 U14.5 U15.5), BOC_DAUGHTER (J8.37)
RED0: BOC_VGA_KB_MOUSE (R10.1), BOC_DAUGHTER (J8.6)
RED1: BOC_VGA_KB_MOUSE (R11.1), BOC_DAUGHTER (J8.8)
REF_CLK: BOC_CLK_ADJ (R52.2 R54.2), BOC_Spartan (U8.129), BOC_DAUGHTER (J9.4)
SCL: BOC_ADC_DAC (HDR8.3 R78.1 R79.2), BOC_DAUGHTER (J9.5)
SDA: BOC_ADC_DAC (HDR8.4 R76.1 R77.2), BOC_DAUGHTER (J9.3)
SPI_CLK: BOC_Spartan (U8.12), BOC_DAUGHTER (J8.46)
SPI_DIN: BOC_Spartan (U8.11), BOC_DAUGHTER (J8.44)
SPI_DOUT: BOC_Spartan (U8.14), BOC_DAUGHTER (J8.50)
SPI_MODE: BOC_Spartan (U8.15), BOC_DAUGHTER (J8.52)
SPI_SEL: BOC_Spartan (U8.13), BOC_DAUGHTER (J8.48)
SW0: BOC_LED_DIPSWITCH (RA21.1 S2.1), BOC_DAUGHTER (J9.44)
SW1: BOC_LED_DIPSWITCH (RA21.2 S2.2), BOC_DAUGHTER (J9.46)
SW2: BOC_LED_DIPSWITCH (RA21.3 S2.3), BOC_DAUGHTER (J9.48)
SW3: BOC_LED_DIPSWITCH (RA21.4 S2.4), BOC_DAUGHTER (J9.50)
SW4: BOC_LED_DIPSWITCH (RA22.1 S2.5), BOC_DAUGHTER (J9.52)
SW5: BOC_LED_DIPSWITCH (RA22.2 S2.6), BOC_DAUGHTER (J9.54)
SW6: BOC_LED_DIPSWITCH (RA22.3 S2.7), BOC_DAUGHTER (J9.56)
SW7: BOC_LED_DIPSWITCH (RA22.4 S2.8), BOC_DAUGHTER (J9.58)
SWC0: BOC_KB (9 pins), BOC_DAUGHTER (J9.18)
SWC1: BOC_KB (9 pins), BOC_DAUGHTER (J9.16)
SWC2: BOC_KB (9 pins), BOC_DAUGHTER (J9.14)
SWC3: BOC_KB (9 pins), BOC_DAUGHTER (J9.6)
SWR0: BOC_KB (8 pins), BOC_DAUGHTER (J9.20)
SWR1: BOC_KB (8 pins), BOC_DAUGHTER (J9.12)
SWR2: BOC_KB (8 pins), BOC_DAUGHTER (J9.10)
SWR3: BOC_KB (8 pins), BOC_DAUGHTER (J9.8)
TCK: BOC_Spartan (U8.78), BOC_Boot (RA9.6 U4.9)
TDI: BOC_Spartan (U8.77), BOC_Boot (RA9.8 U4.7)
TDO: BOC_Spartan (U8.75), BOC_Boot (U4.17)
TEST: BOC_KB (R55.2 SW17.1 SW17.2), BOC_DAUGHTER (J8.81)
TMS: BOC_Spartan (U8.76), BOC_Boot (RA9.7 U4.5)
VDRIVE: BOC_VGA_KB_MOUSE (D5.3 J3.14), BOC_DAUGHTER (J8.20)
VREF: BOC_PWR (R56.2 R57.1 U11.1), BOC_DAUGHTER (J8.91)